# Altium schematic sheet Cover Sheet.SchDoc
size B; Organization: ToyBuilder Labs; Address1: 1100 S. Garfield Avenue; Address2: Alhambra, California 91801; Address4: +1 (626) 808-4010; DocumentNumber: 1; SheetNumber: 1; SheetTotal: 3
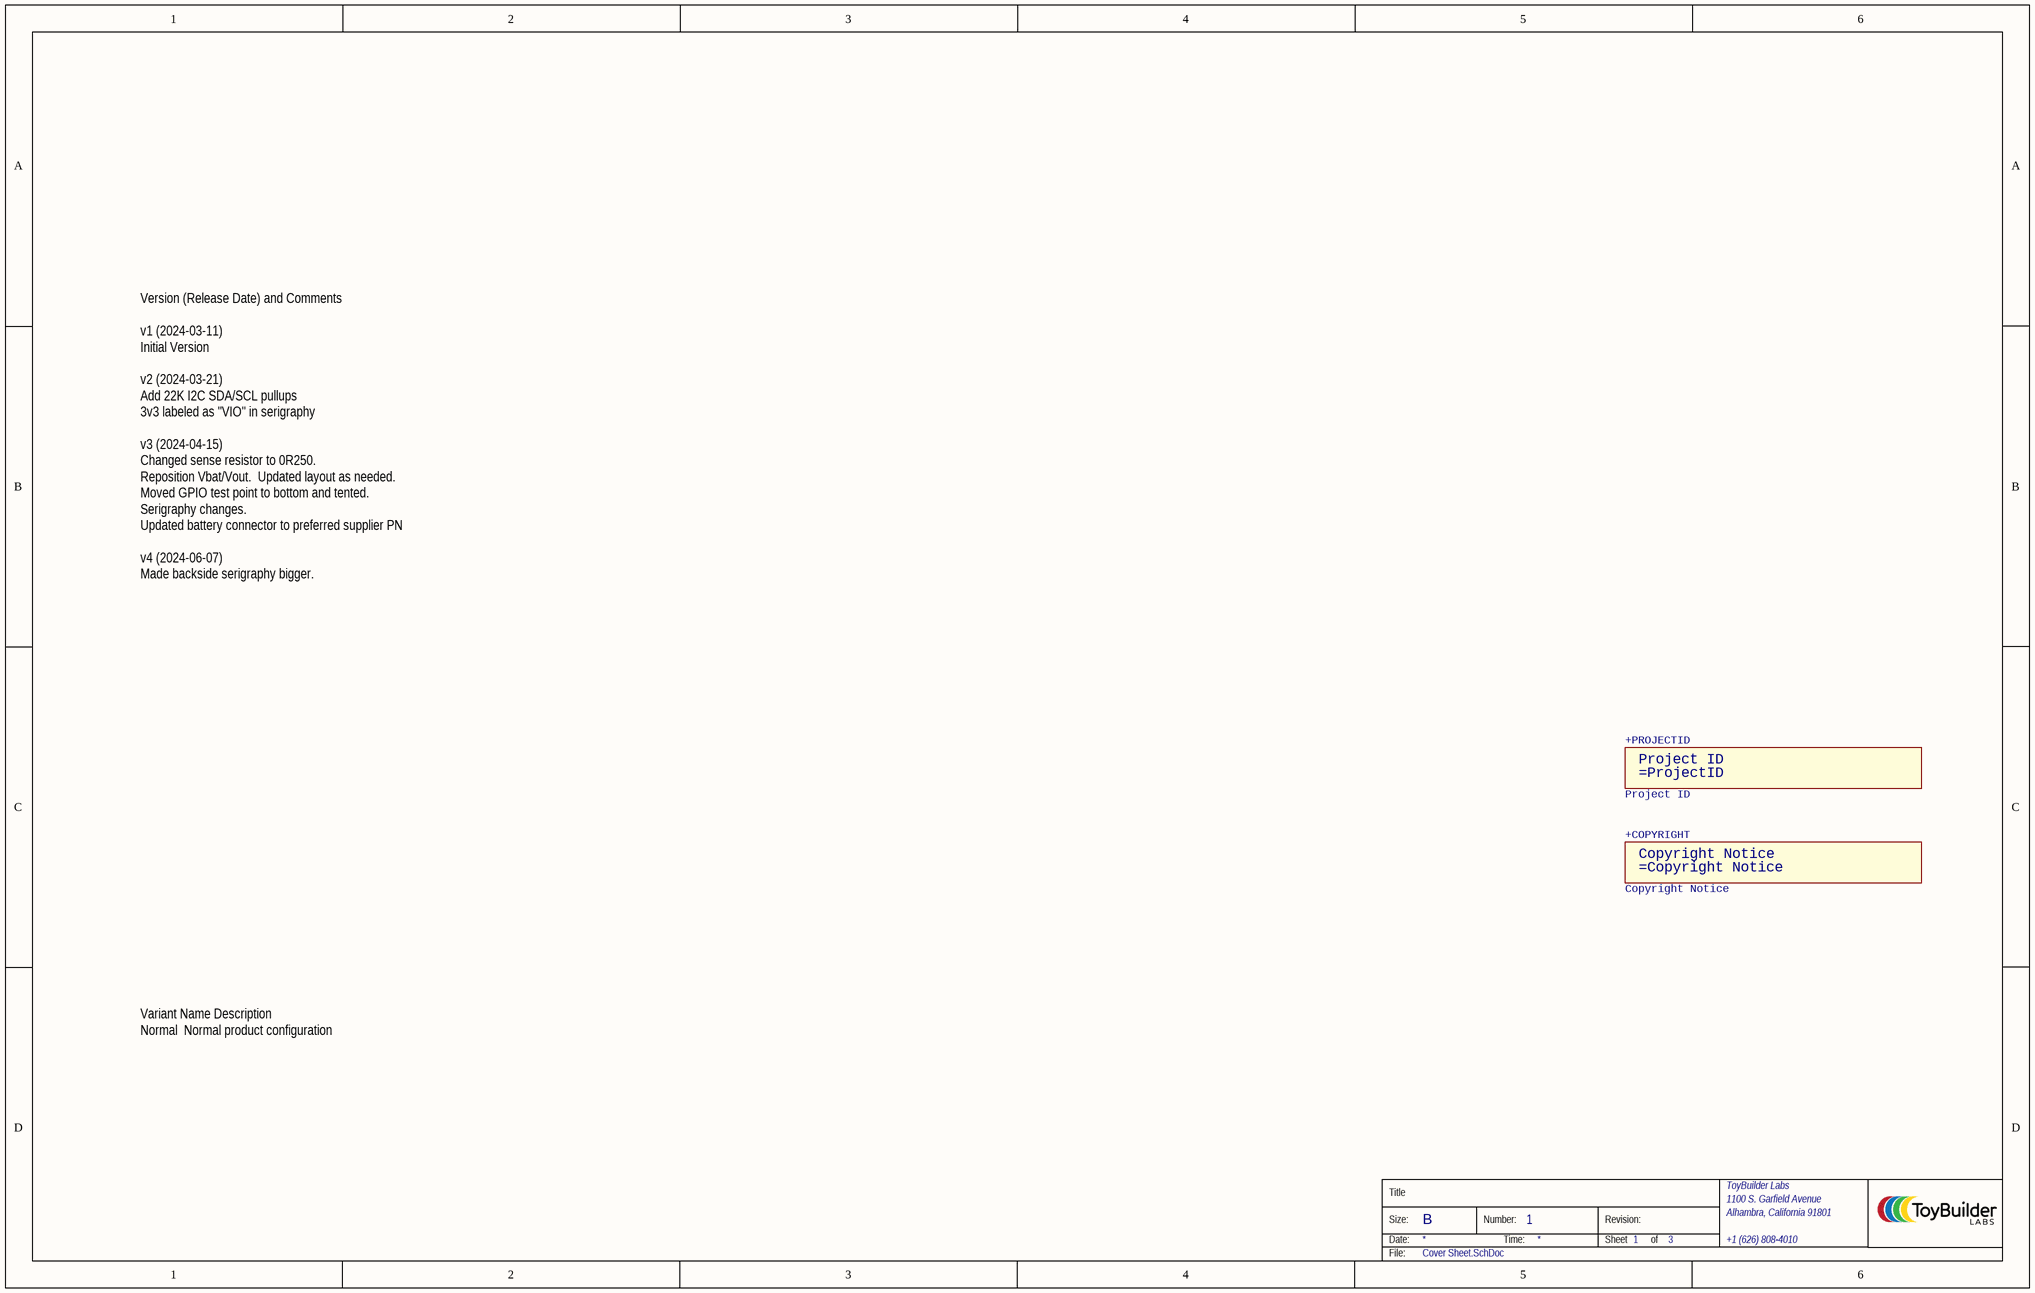
[diagram p0: Cover Sheet.SchDoc]

## Parts
+COPYRIGHT  Copyright Notice  [COPYRIGHT_MARK]  (graphical)
+PROJECTID  Project ID  [PROJECTID_MARK]  (graphical)

## Notes on the sheet
- Version (Release Date) and Comments
  v1 (2024-03-11)
  Initial Version
  v2 (2024-03-21)
  Add 22K I2C SDA/SCL pullups
  3v3 labeled as "VIO" in serigraphy
  v3 (2024-04-15)
  Changed sense resistor to 0R250.
  Reposition Vbat/Vout.  Updated layout as needed.
  Moved GPIO test point to bottom and tented.
  Serigraphy changes.
  Updated battery connector to preferred supplier PN
  v4 (2024-06-07)
  Made backside serigraphy bigger.
- Variant Name	Description
  Normal		Normal product configuration
- Title
- Size:
- Date:
- B
- Number:
- Time:
- Revision:
- Sheet
- of
- File:

## Library data of the parts
+COPYRIGHT = COPYRIGHT_MARK
+PROJECTID = PROJECTID_MARK